# Altium project 2017-7-13-STM32F103XX最小系统板.PrjPcb
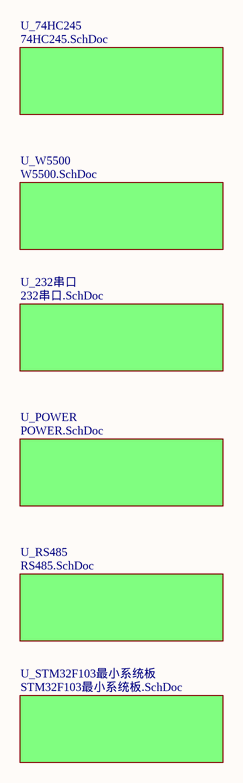
[diagram p0: SYS.SchDoc]
7 sheets, 241 parts. Net scope: global (net labels, ports and power ports of the same name join across sheets).
Board file: STM32F103最小系统板V1_0.PcbDoc
Sheets:
  SYS.SchDoc
    U_74HC245 = 74HC245.SchDoc
    U_232串口 = 232串口.SchDoc
    U_POWER = POWER.SchDoc
    U_RS485 = RS485.SchDoc
    U_STM32F103最小系统板 = STM32F103最小系统板.SchDoc
    U_W5500 = W5500.SchDoc

## Sheet SYS.SchDoc
size A4

### Sub-sheets
U_74HC245 = 74HC245.SchDoc: no entries
U_232串口 = 232串口.SchDoc: no entries
U_POWER = POWER.SchDoc: no entries
U_RS485 = RS485.SchDoc: no entries
U_STM32F103最小系统板 = STM32F103最小系统板.SchDoc: no entries
U_W5500 = W5500.SchDoc: no entries

## Sheet 74HC245.SchDoc
size A4
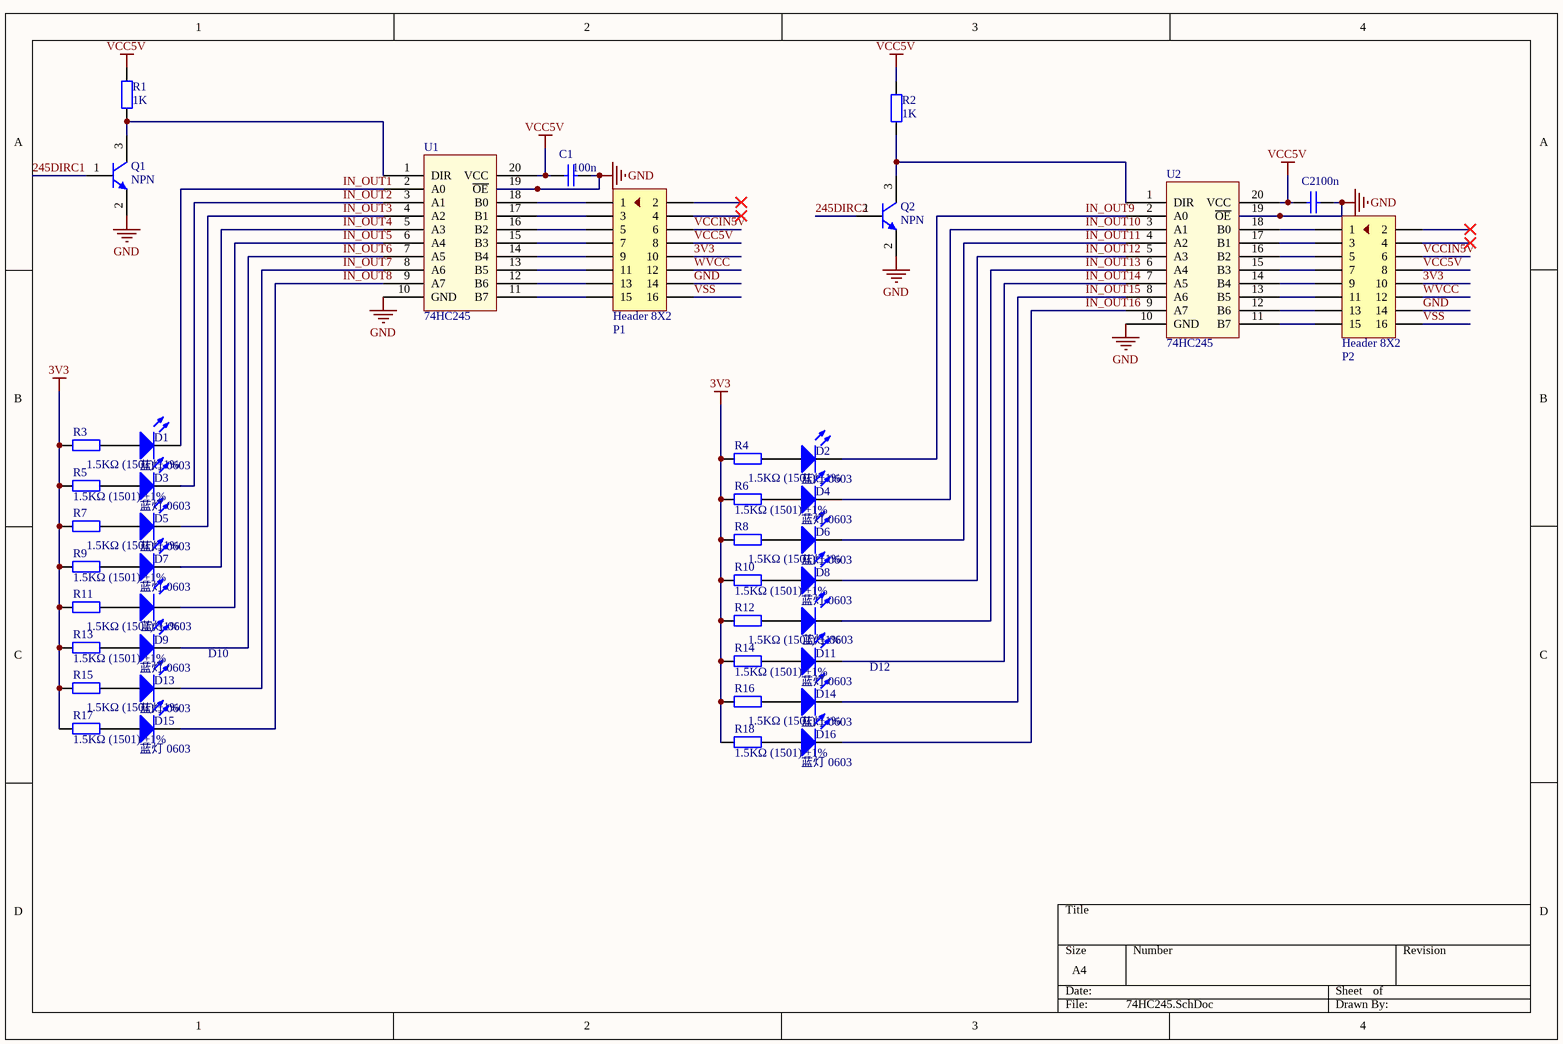
[diagram p1: 74HC245.SchDoc]

### Parts
(Parts that share a designator on the sheet are numbered #1, #2 ... from top to bottom, then left to right.)
C1#1  value 100n  [LC-0603_C]  (hidden comment: 104)
C2#1  value 100n  [LC-0603_C]  (hidden comment: 104)
D1#1  蓝灯 0603  [LC-0603_LED_S1]
D2  蓝灯 0603  [LC-0603_LED_S1]
D3  蓝灯 0603  [LC-0603_LED_S1]
D4  蓝灯 0603  [LC-0603_LED_S1]
D5  蓝灯 0603  [LC-0603_LED_S1]
D6  蓝灯 0603  [LC-0603_LED_S1]
D7#1  蓝灯 0603  [LC-0603_LED_S1]
D8  蓝灯 0603  [LC-0603_LED_S1]
D9  蓝灯 0603  [LC-0603_LED_S1]
D10  蓝灯 0603  [LC-0603_LED_S1]
D11  蓝灯 0603  [LC-0603_LED_S1]
D12  蓝灯 0603  [LC-0603_LED_S1]
D13  蓝灯 0603  [LC-0603_LED_S1]
D14  蓝灯 0603  [LC-0603_LED_S1]
D15  蓝灯 0603  [LC-0603_LED_S1]
D16#1  蓝灯 0603  [LC-0603_LED_S1]
P1  Header 8X2  [DC3-16P-2.54mm]
P2  Header 8X2  [DC3-16P-2.54mm]
Q1#1  NPN  [SOT23-3]
Q2  NPN  [SOT23-3]
R1#1  value 1K  [0603-1]  (hidden comment: Res1)
R2  value 1K  [0603-1]  (hidden comment: Res1)
R3#1  1.5KΩ (1501) ±1%  [LC-0603_R]
R4#1  1.5KΩ (1501) ±1%  [LC-0603_R]
R5  1.5KΩ (1501) ±1%  [LC-0603_R]
R6  1.5KΩ (1501) ±1%  [LC-0603_R]
R7  1.5KΩ (1501) ±1%  [LC-0603_R]
R8  1.5KΩ (1501) ±1%  [LC-0603_R]
R9  1.5KΩ (1501) ±1%  [LC-0603_R]
R10  1.5KΩ (1501) ±1%  [LC-0603_R]
R11  1.5KΩ (1501) ±1%  [LC-0603_R]
R12  1.5KΩ (1501) ±1%  [LC-0603_R]
R13  1.5KΩ (1501) ±1%  [LC-0603_R]
R14  1.5KΩ (1501) ±1%  [LC-0603_R]
R15#1  1.5KΩ (1501) ±1%  [LC-0603_R]
R16#1  1.5KΩ (1501) ±1%  [LC-0603_R]
R17#1  1.5KΩ (1501) ±1%  [LC-0603_R]
R18#1  1.5KΩ (1501) ±1%  [LC-0603_R]
U1  74HC245  [LC-TSSOP-20]
U2  74HC245  [LC-TSSOP-20]

### Nets
3V3: P1.10 P2.10 R3#1.1 R4#1.1 R5.1 R6.1 R7.1 R8.1 R9.1 R10.1 R11.1 R12.1 R13.1 R14.1 R15#1.1 R16#1.1 R17#1.1 R18#1.1
GND: C1#1.1 C2#1.1 P1.14 P2.14 Q1#1.2(E) Q2.2(E) U1.10(GND) U1.19(~{OE}) U2.10(GND) U2.19(~{OE})
VCC5V: C1#1.2 C2#1.2 P1.8 P2.8 R1#1.2 R2.2 U1.20(VCC) U2.20(VCC)
VCCIN5V: P1.6 P2.6
VSS: P1.16 P2.16
WVCC: P1.12 P2.12  [project net VCC3.3]
245DIRC1: Q1#1.1(B)
245DIRC2: Q2.1(B)
IN_OUT1: D1#1.K U1.2(A0)
IN_OUT2: D3.K U1.3(A1)
IN_OUT3: D5.K U1.4(A2)
IN_OUT4: D7#1.K U1.5(A3)
IN_OUT5: D10.K U1.6(A4)
IN_OUT6: D9.K U1.7(A5)
IN_OUT7: D13.K U1.8(A6)
IN_OUT8: D15.K U1.9(A7)
IN_OUT9: D2.K U2.2(A0)
IN_OUT10: D4.K U2.3(A1)
IN_OUT11: D6.K U2.4(A2)
IN_OUT12: D8.K U2.5(A3)
IN_OUT13: D12.K U2.6(A4)
IN_OUT14: D11.K U2.7(A5)
IN_OUT15: D14.K U2.8(A6)
IN_OUT16: D16#1.K U2.9(A7)
NetD1#1_A: D1#1.A R3#1.2
NetD2_A: D2.A R4#1.2
NetD3_A: D3.A R5.2
NetD4_A: D4.A R6.2
NetD5_A: D5.A R7.2
NetD6_A: D6.A R8.2
NetD7#1_A: D7#1.A R9.2
NetD8_A: D8.A R10.2
NetD9_A: D9.A R13.2
NetD10_A: D10.A R11.2
NetD11_A: D11.A R14.2
NetD12_A: D12.A R12.2
NetD13_A: D13.A R15#1.2
NetD14_A: D14.A R16#1.2
NetD15_A: D15.A R17#1.2
NetD16#1_A: D16#1.A R18#1.2
NetP1_1: P1.1 U1.18(B0)
NetP1_3: P1.3 U1.17(B1)
NetP1_5: P1.5 U1.16(B2)
NetP1_7: P1.7 U1.15(B3)
NetP1_9: P1.9 U1.14(B4)
NetP1_11: P1.11 U1.13(B5)
NetP1_13: P1.13 U1.12(B6)
NetP1_15: P1.15 U1.11(B7)
NetP2_1: P2.1 U2.18(B0)
NetP2_3: P2.3 U2.17(B1)
NetP2_5: P2.5 U2.16(B2)
NetP2_7: P2.7 U2.15(B3)
NetP2_9: P2.9 U2.14(B4)
NetP2_11: P2.11 U2.13(B5)
NetP2_13: P2.13 U2.12(B6)
NetP2_15: P2.15 U2.11(B7)
NetQ1#1_3: Q1#1.3(C) R1#1.1 U1.1(DIR)
NetQ2_3: Q2.3(C) R2.1 U2.1(DIR)

Not connected (* = marked no-connect by the designer): P1 2* 4*; P2 2* 4*

### Library data of the parts
C1#1 C2#1 = Cap: Capacitor; Published: 8-Jun-2000; LatestRevisionDate: 17-Jul-2002; LatestRevisionNote: Re-released for DXP Platform.; PackageReference: RAD-0.3; Publisher: Altium Limited
D1#1 D2-D6 D7#1 D8-D15 D16#1 = 0603 蓝灯: 发光二极管; ComponentLink1Description: 供应商链接; ComponentLink1URL: http://www.szlcsc.com/product/details_73150.html; Package: 0603; Supplier: LC; SuppliersPartNumber: C72041
P1 P2 = Header 8X2: 接插件; LatestRevisionDate: 17-Jul-2002; LatestRevisionNote: Re-released for DXP Platform.; Publisher: Altium Limited
Q1#1 Q2 = NPN1: 贴片三极管; Published: 8-Jun-2000; LatestRevisionDate: 15-Jan-2003; LatestRevisionNote: PCB Footprint 'BCY-W3/D4.7' replaced; DatasheetDocument: 1997; PackageDocument: Sep-1998; PackageReference: TO-92A; Publisher: Altium Limited; Code_JEDEC: TO-92A; ComponentLink1Description: Manufacturer Link; ComponentLink1URL: http://www.fairchildsemi.com/; ComponentLink2Description: Datasheet; ComponentLink2URL: http://www.fairchildsemi.com/ds/2N%2F2N3904.pdf
R1#1 R2 = Res1: 贴片电阻; Published: 8-Jun-2000; LatestRevisionDate: 17-Jul-2002; LatestRevisionNote: Re-released for DXP Platform.; PackageReference: AXIAL-0.4; Publisher: Altium Limited
R3#1 R4#1 R5-R14 R15#1 R16#1 R17#1 R18#1 = 0603 1.5KΩ (1501) 1%: 贴片电阻; ComponentLink1Description: 供应商链接; ComponentLink1URL: http://www.szlcsc.com/product/details_23570.html; Package: 0603; Supplier: LC; SuppliersPartNumber: C22843
U1 U2 = 7

## Sheet 232串口.SchDoc
size A4
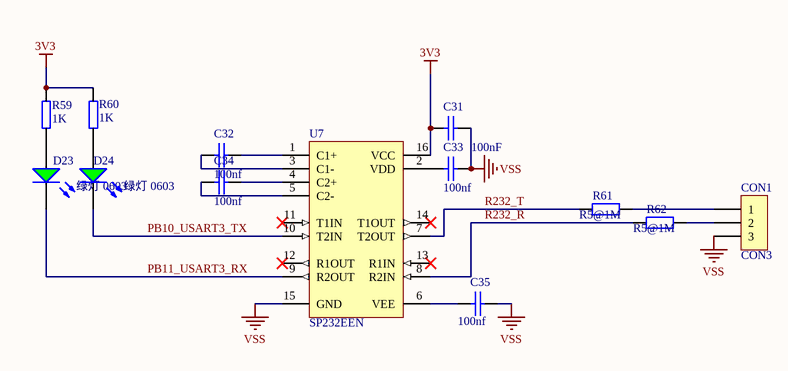
[diagram p2: 232串口.SchDoc]

### Parts
(Parts that share a designator on the sheet are numbered #1, #2 ... from top to bottom, then left to right.)
C31  100nF  [LC-0603_C]
C32  100nf  [LC-0603_C]
C33  100nf  [LC-0603_C]
C34  100nf  [LC-0603_C]
C35  100nf  [LC-0603_C]
CON1#1  CON3  [VH3.96-W-3P]
D23  绿灯 0603  [LC-0603_LED_S1]
D24  绿灯 0603  [LC-0603_LED_S1]
R59  1K  [LC-0603_R]
R60  1K  [LC-0603_R]
R61  R5@1M  [0603-1]
R62  R5@1M  [0603-1]
U7  SP232EEN  [SOIC-16]

### Nets
3V3: C31.2 R59.2 R60.1 U7.16(VCC)
VSS: C31.1 C33.2 C35.2 CON1#1.3 U7.15(GND)
PB10_USART3_TX: D24.K U7.10(T2IN)
PB11_USART3_RX: D23.K U7.9(R2OUT)
R232_R: R62.2 U7.8(R2IN)
R232_T: R61.2 U7.7(T2OUT)
NetC32_1: C32.1 U7.3(C1-)
NetC32_2: C32.2 U7.1(C1+)
NetC33_1: C33.1 U7.2(VDD)
NetC34_1: C34.1 U7.5(C2-)
NetC34_2: C34.2 U7.4(C2+)
NetC35_1: C35.1 U7.6(VEE)
NetCON1#1_1: CON1#1.1 R61.1
NetCON1#1_2: CON1#1.2 R62.1
NetD23_A: D23.A R59.1
NetD24_A: D24.A R60.2

Not connected (* = marked no-connect by the designer): U7 11(T1IN)* 12(R1OUT)* 13(R1IN)* 14(T1OUT)*

### Library data of the parts
C31-C35 = CAP: Capacitor
CON1#1 = CON3: Connector
D23 D24 = 0603 绿灯: 发光二极管; ComponentLink1Description: 供应商链接; ComponentLink1URL: http://www.szlcsc.com/product/details_73152.html; Package: 0603; Supplier: LC; SuppliersPartNumber: C72043
R59 R60 = RES2
R61 R62 = Res2: Resistor; Value: 10K; Published: 8-Jun-2000; LatestRevisionDate: 17-Jul-2002; LatestRevisionNote: Re-released for DXP Platform.; PackageReference: AXIAL-0.4; Publisher: Altium Limited
U7 = MAX232: +5V Powered, Multi-Channel RS-232 Driver/Receiver; Published: 16-Jan-2001; LatestRevisionDate: 13-Apr-2006; LatestRevisionNote: IPC-7351 Footprint Added.; PackageReference: NSO16; Publisher: Altium Limited; PackageDescription: 16-Pin Small Outline Integrated Circuit 1.27 mm Pitch; Code_JEDEC: MS-012-AC; Code_IPC: SOIC127P600-16; ComponentLink1Description: Manufacturer Link; ComponentLink1URL: http://www.maxim-ic.com/; ComponentLink2Description: Datasheet; ComponentLink2URL: http://pdfserv.maxim-ic.com/en/ds/MAX220-MAX249.pdf

## Sheet POWER.SchDoc
size A4
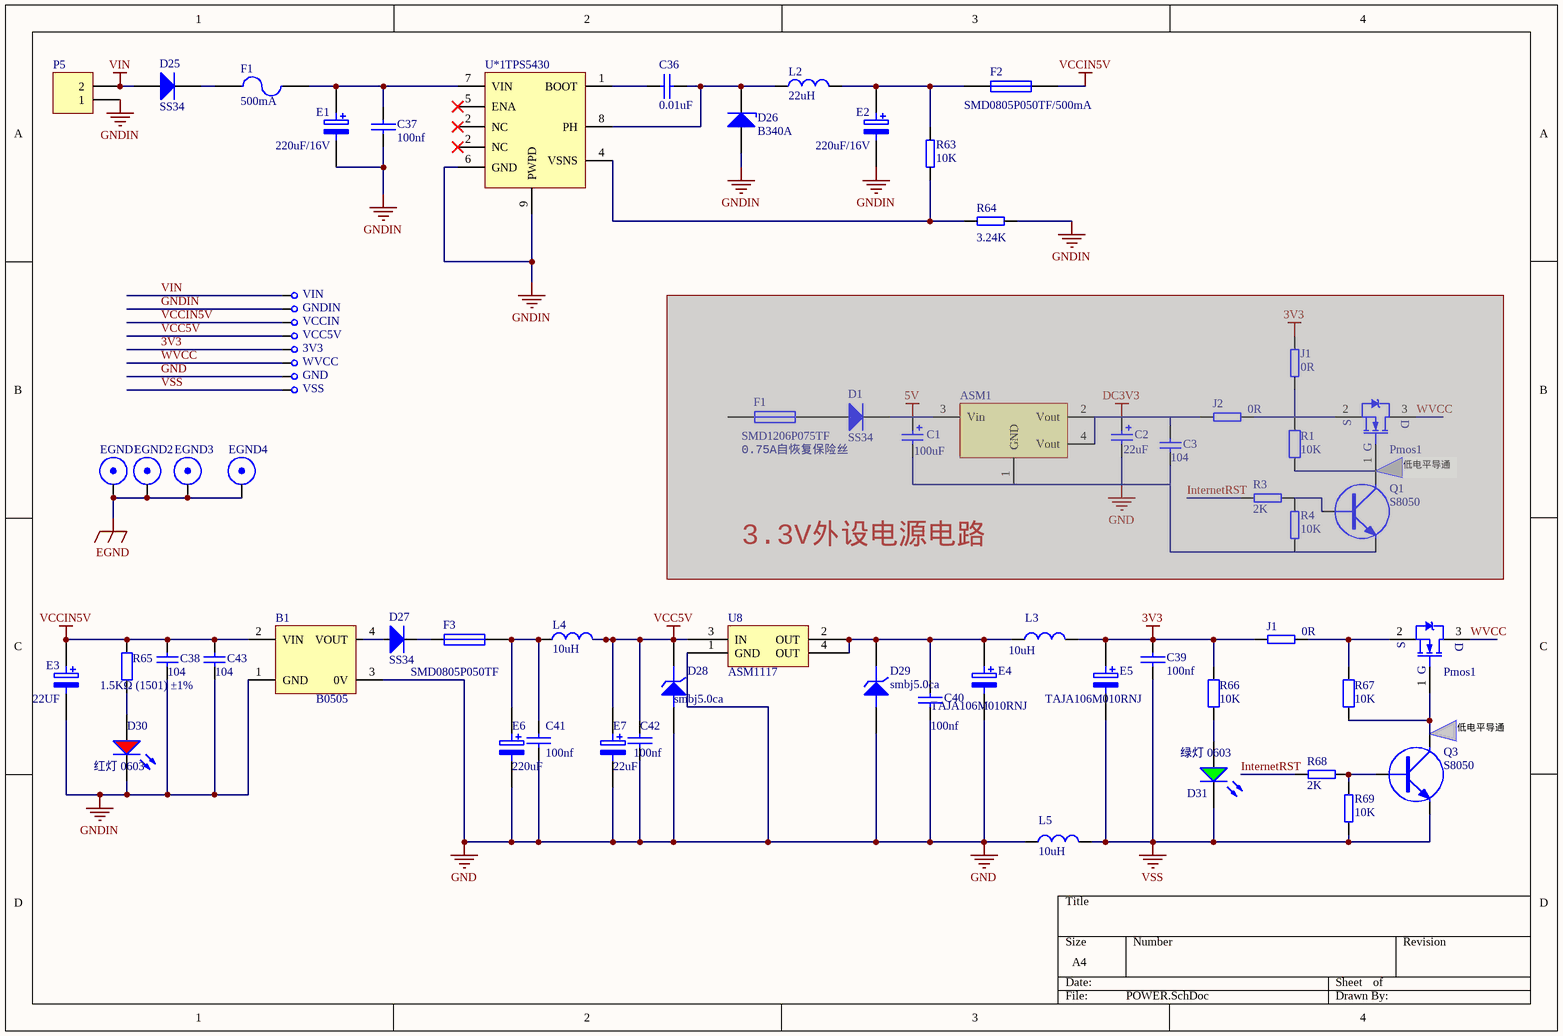
[diagram p3: POWER.SchDoc]

### Parts
(Parts that share a designator on the sheet are numbered #1, #2 ... from top to bottom, then left to right.)
3V3  CHECK  [CHECK-B]  (value not drawn)
ASM1  ASM1117-3.3  [LC-SOT-223]  (value not drawn)  (masked out: inside a compile mask, not in the netlist)
B1  B0505  [B0505D-1WR2]
C1#2  100uF  [HONOR_63X54]  (masked out: inside a compile mask, not in the netlist)
C2#2  22uF  [HONOR_63X54]  (masked out: inside a compile mask, not in the netlist)
C3#1  104  [LC-0603_C]  (masked out: inside a compile mask, not in the netlist)
C36  0.01uF  [C-0805]
C37  100nf  [1206]
C38  104  [LC-0603_C]
C39  100nf  [LC-0603_C]
C40  100nf  [LC-0603_C]
C41  100nf  [LC-0603_C]
C42  100nf  [LC-0603_C]
C43  104  [LC-0603_C]
D1#2  SS34  [LC-SMA(DO-214AC)_S5]  (masked out: inside a compile mask, not in the netlist)
D25  SS34  [D-SMA]
D26  value B340A  [D-SMB]  (hidden comment: Diode-Z)
D27  SS34  [D-SMA]
D28  smbj5.0ca  [LC-SMB(DO-214AA)_S1]
D29  smbj5.0ca  [LC-SMB(DO-214AA)_S1]
D30  红灯 0603  [LC-0603_LED_S1]
D31  绿灯 0603  [LC-0603_LED_S1]
E1  220uF/16V  [C-RB-SD6]
E2  220uF/16V  [C-RB-SD6]
E3  22UF  [C-RB-SD6]
E4  TAJA106M010RNJ  [LC-CASE-A_3216]
E5  TAJA106M010RNJ  [LC-CASE-A_3216]
E6#1  220uF  [C-RB-SD6]
E7  22uF  [C-RB-SD6]
EGND1  EGND  [H-6-3.2m]  (value not drawn)
EGND2  EGND  [H-6-3.2m]  (value not drawn)
EGND3  EGND  [H-6-3.2m]  (value not drawn)
EGND4  EGND  [H-6-3.2m]  (value not drawn)
F1#1  value 500mA  [1206]  (hidden comment: Fuse2)
F1#2  SMD1206P075TF  [LC-1206_R]  (masked out: inside a compile mask, not in the netlist)
F2#1  SMD0805P050TF/500mA  [0805-1]
F3  SMD0805P050TF  [0805-1]
GND  CHECK  [CHECK-B]  (value not drawn)
GNDIN  CHECK  [CHECK-B]  (value not drawn)
J1#1  0R  [LC-0603_L]  (masked out: inside a compile mask, not in the netlist)
J1#2  0R  [LC-0603_L]
J2  0R  [LC-0603_L]  (masked out: inside a compile mask, not in the netlist)
L2  value 22uH  [L-SMD-7]  (hidden comment: Inductor)
L3  value 10uH  [0805-1]  (hidden comment: Inductor)
L4  value 10uH  [L-SMD-3]  (hidden comment: Inductor)
L5  value 10uH  [0805-1]  (hidden comment: Inductor)
P5  Header 2  [WJ2EDGR508-2]  (value not drawn)
Pmos1#1  SI2301  [LC-SOT-23(SOT-23-3)]  (value not drawn)  (masked out: inside a compile mask, not in the netlist)
Pmos1#2  SI2301  [LC-SOT-23(SOT-23-3)]  (value not drawn)
Q1#2  S8050  [LC-SOT-23(SOT-23-3)]  (masked out: inside a compile mask, not in the netlist)
Q3  S8050  [LC-SOT-23(SOT-23-3)]
R1#2  10K  [LC-0603_R]  (masked out: inside a compile mask, not in the netlist)
R3#2  2K  [LC-0603_R]  (masked out: inside a compile mask, not in the netlist)
R4#2  10K  [LC-0603_R]  (masked out: inside a compile mask, not in the netlist)
R63  10K  [LC-0603_R]
R64  3.24K  [LC-0603_R]
R65  1.5KΩ (1501) ±1%  [LC-0603_R]
R66  10K  [LC-0603_R]
R67  10K  [LC-0603_R]
R68  2K  [LC-0603_R]
R69  10K  [LC-0603_R]
U8  ASM1117  [SOT223]
U*1  TPS5430  [SOIC8]
VCC5V  CHECK  [CHECK-B]  (value not drawn)
VCCIN  CHECK  [CHECK-B]  (value not drawn)
VIN  CHECK  [CHECK-B]  (value not drawn)
VSS  CHECK  [CHECK-B]  (value not drawn)
WVCC  CHECK  [CHECK-B]  (value not drawn)

### Nets
3V3: 3V3.1 C39.2 E5.1 J1#2.2 L3.2 R66.1
EGND: EGND1.0 EGND2.0 EGND3.0 EGND4.0
GND: B1.3(0V) C40.1 C41.1 C42.1 D28.1(A) D29.1(A) E4.2 E6#1.2 E7.2 GND.1 L5.1 U8.1(GND)
GNDIN: B1.1(GND) C37.1 C38.2 C43.2 D26.1(A) D30.K E1.2 E2.2 E3.2 GNDIN.1 P5.1 R64.1 U*1.6(GND) U*1.9(PWPD)
VCC5V: C42.2 D28.2(K) E7.1 L4.2 U8.3(IN) VCC5V.1
VCCIN5V: B1.2(VIN) C38.1 C43.1 E3.1 F2#1.2 R65.2 VCCIN.1
VIN: D25.1(A) P5.2 VIN.1
VSS: C39.1 D31.K E5.2 L5.2 Q3.2 R69.1 VSS.1
WVCC: Pmos1#2.3(D) WVCC.1  [project net VCC3.3]
InternetRST: R68.2
NetB1_4: B1.4(VOUT) D27.1(A)
NetC36_1: C36.1 D26.2(K) L2.1 U*1.8(PH)
NetC36_2: C36.2 U*1.1(BOOT)
NetC37_2: C37.2 E1.1 F1#1.2 U*1.7(VIN)
NetC40_2: C40.2 D29.2(K) E4.1 L3.1 U8.2(OUT) U8.4(OUT)
NetC41_2: C41.2 E6#1.1 F3.2 L4.1
NetD25_2: D25.2(K) F1#1.1
NetD27_2: D27.2(K) F3.1
NetD30_A: D30.A R65.1
NetD31_A: D31.A R66.2
NetE2_1: E2.1 F2#1.1 L2.2 R63.2
NetJ1#2_1: J1#2.1 Pmos1#2.2(S) R67.2
NetPmos1#2_1: Pmos1#2.1(G) Q3.3 R67.1
NetQ3_1: Q3.1 R68.1 R69.2
NetR63_1: R63.1 R64.2 U*1.4(VSNS)

Not connected (* = marked no-connect by the designer): U*1 2(NC)* 5(ENA)*

### Notes on the sheet
- (near F1#2) 0.75A自恢复保险丝
- 低电平导通
- 3.3V外设电源电路
- (near Q3) 低电平导通

### Library data of the parts
3V3 GND GNDIN VCC5V VCCIN VIN VSS WVCC = CHECK: 测试点
ASM1 = VOLTREG1
C1#2 C2#2 = Cap Pol1: Polarized Capacitor (Radial); Published: 8-Jun-2000; Revision: July-2002: Re-released for DXP Platform.; Publisher: Altium Limited
  C1#2: Value: 100uF
  C2#2: Value: 22uF
C3#1 C38 C43 = Cap: Capacitor; Value: 100nF; Published: 8-Jun-2000; Revision: July-2002: Re-released for DXP Platform.; Publisher: Altium Limited
C36 C37 C39-C42 = CAP: Capacitor
D1#2 = Diode: Default Diode; Published: 8-Jun-2000; LatestRevisionDate: 17-Jul-2002; LatestRevisionNote: Re-released for DXP Platform.; PackageDocument: Sep-1996; PackageReference: SMC; Publisher: Altium Limited; Code_JEDEC: DO-214-AB
D25 D27 = Diode: 二极管; Published: 8-Jun-2000; LatestRevisionDate: 17-Jul-2002; LatestRevisionNote: Re-released for DXP Platform.; PackageDocument: Sep-1996; PackageReference: SMC; Publisher: Altium Limited; Code_JEDEC: DO-214-AB
D26 = Diode-Z: 稳压二极管; Published: 8-Jun-2000; LatestRevisionDate: 17-Jul-2002; LatestRevisionNote: Re-released for DXP Platform.; PackageReference: SMB; Publisher: Altium Limited; Code_JEDEC: DO-214-AA
D28 D29 = ZENER3: Zener Diode
D30 = 0603 红灯: 发光二极管; ComponentLink1Description: 供应商链接; ComponentLink1URL: http://www.szlcsc.com/product/details_2659.html; Package: 0603; Supplier: LC; SuppliersPartNumber: C2286
D31 = 0603 绿灯: 发光二极管; ComponentLink1Description: 供应商链接; ComponentLink1URL: http://www.szlcsc.com/product/details_73152.html; Package: 0603; Supplier: LC; SuppliersPartNumber: C72043
E1-E5 E6#1 E7 = ELECTRO2: Electrolytic Capacitor
F1#1 = Fuse2: 可恢复保险丝; Published: 8-Jun-2000; LatestRevisionDate: 17-Jul-2002; LatestRevisionNote: Re-released for DXP Platform.; PackageReference: PIN-W2/E2.8; Publisher: Altium Limited
F1#2 F2#1 F3 = Fuse 1: Fuse; Published: 8-Jun-2000; LatestRevisionDate: 17-Jul-2002; LatestRevisionNote: Re-released for DXP Platform.; PackageReference: PIN-W2/E2.8; Publisher: Altium Limited
J1#1 J1#2 J2 R3#2 R4#2 R68 R69 = RES
L2-L5 = Inductor: 电感; Code_IEC: 1005; Published: 8-Jun-2000; LatestRevisionDate: 17-Jul-2002; LatestRevisionNote: Re-released for DXP Platform.; PackageReference: 0402-A; Publisher: Altium Limited; Code_JEITA: 0402
P5 = Header 2: Header, 2-Pin; LatestRevisionDate: 17-Jul-2002; LatestRevisionNote: Re-released for DXP Platform.; Publisher: Altium Limited
Pmos1#1 Pmos1#2 = N-MOS
Q1#2 Q3 = NPN
R1#2 R67 = Res2: Resistor; Published: 8-Jun-2000; LatestRevisionDate: 17-Jul-2002; LatestRevisionNote: Re-released for DXP Platform.; PackageReference: AXIAL-0.4; Publisher: Altium Limited; Value: 10K
R63 R64 = RES2
R65 = 0603 1.5KΩ (1501) 1%: 贴片电阻; ComponentLink1Description: 供应商链接; ComponentLink1URL: http://www.szlcsc.com/product/details_23570.html; Package: 0603; Supplier: LC; SuppliersPartNumber: C22843
R66 = Res2: Resistor; Value: 1K; Published: 8-Jun-2000; LatestRevisionDate: 17-Jul-2002; LatestRevisionNote: Re-released for DXP Platform.; PackageReference: AXIAL-0.4; Publisher: Altium Limited
U8 = ASM1: 3.3V稳压芯片

## Sheet RS485.SchDoc
size A4
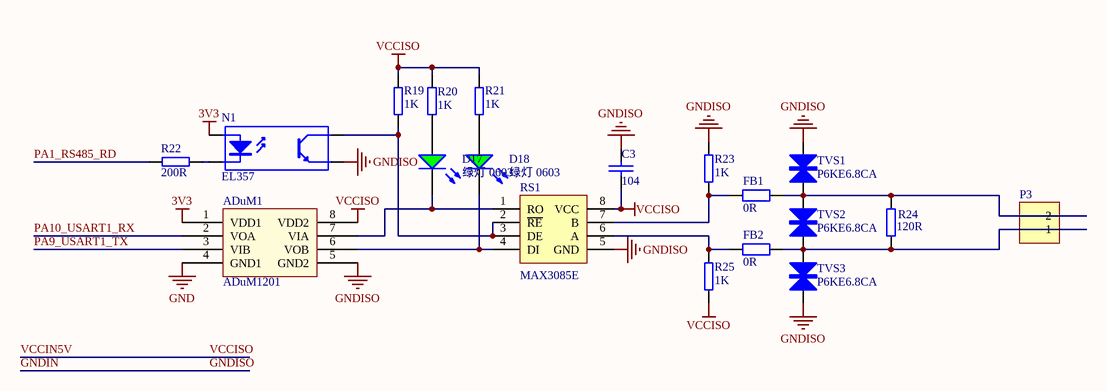
[diagram p4: RS485.SchDoc]

### Parts
(Parts that share a designator on the sheet are numbered #1, #2 ... from top to bottom, then left to right.)
ADuM1  ADuM1201  [SOIC-8]
C3#2  104  [LC-0603_C]
D17  绿灯 0603  [LC-0603_LED_S1]
D18  绿灯 0603  [LC-0603_LED_S1]
FB1  0R  [LC-0603_L]
FB2  0R  [LC-0603_L]
N1  EL357  [lc-sop-4_P2.54]
P3  Header 2  [WJ2EDGR508-2]  (value not drawn)
R19  1K  [LC-0603_R]
R20  1K  [LC-0603_R]
R21  1K  [LC-0603_R]
R22  200R  [LC-0603_R]
R23  1K  [LC-0603_R]
R24  120R  [LC-0603_R]
R25  1K  [LC-0603_R]
RS1  MAX3085E  [SOIC-8]
TVS1  P6KE6.8CA  [TVS]
TVS2  P6KE6.8CA  [TVS]
TVS3  P6KE6.8CA  [TVS]

### Nets
3V3: ADuM1.1(VDD1) N1.1(A)
GND: ADuM1.4(GND1)
GNDIN: ADuM1.5(GND2) C3#2.1 N1.3(E) R23.1 RS1.5(GND) TVS1.2 TVS3.1  [also labelled GNDISO]
VCCIN5V: ADuM1.8(VDD2) C3#2.2 R19.1 R20.2 R21.1 R25.2 RS1.8(VCC)  [also labelled VCCISO]
PA1_RS485_RD: R22.1
PA9_USART1_TX: ADuM1.3(VIB)
PA10_USART1_RX: ADuM1.2(VOA)
NetADuM1_6: ADuM1.6(VOB) D18.K RS1.4(DI)
NetADuM1_7: ADuM1.7(VIA) D17.K RS1.1(RO)
NetD17_A: D17.A R20.1
NetD18_A: D18.A R21.2
NetFB1_1: FB1.1 P3.2 R24.2 TVS1.1 TVS2.2
NetFB1_2: FB1.2 R23.2 RS1.7(B)
NetFB2_1: FB2.1 P3.1 R24.1 TVS2.1 TVS3.2
NetFB2_2: FB2.2 R25.1 RS1.6(A)
NetN1_2: N1.2(K) R22.2
NetN1_4: N1.4(C) R19.2 RS1.2(~{RE}) RS1.3(DE)

### Library data of the parts
C3#2 = CAP
D17 D18 = 0603 绿灯: 发光二极管; ComponentLink1Description: 供应商链接; ComponentLink1URL: http://www.szlcsc.com/product/details_73152.html; Package: 0603; Supplier: LC; SuppliersPartNumber: C72043
FB1 FB2 = Res2: Resistor; Published: 8-Jun-2000; LatestRevisionDate: 17-Jul-2002; LatestRevisionNote: Re-released for DXP Platform.; PackageReference: AXIAL-0.4; Publisher: Altium Limited; Value: 0R
N1 = ST188: 反射式光电传感器; Published: 24-Mar-1999; LatestRevisionDate: 04-Mar-2005; LatestRevisionNote: Sch pins 3 & 4 Swapped.; DatasheetDocument: Nov-2003; PackageReference: DIP-4; Publisher: Altium Limited
P3 = Header 2: Header, 2-Pin; LatestRevisionDate: 17-Jul-2002; LatestRevisionNote: Re-released for DXP Platform.; Publisher: Altium Limited
R19-R22 = RES2
R23-R25 = RES
TVS1-TVS3 = TVS

## Sheet STM32F103最小系统板.SchDoc
size A3
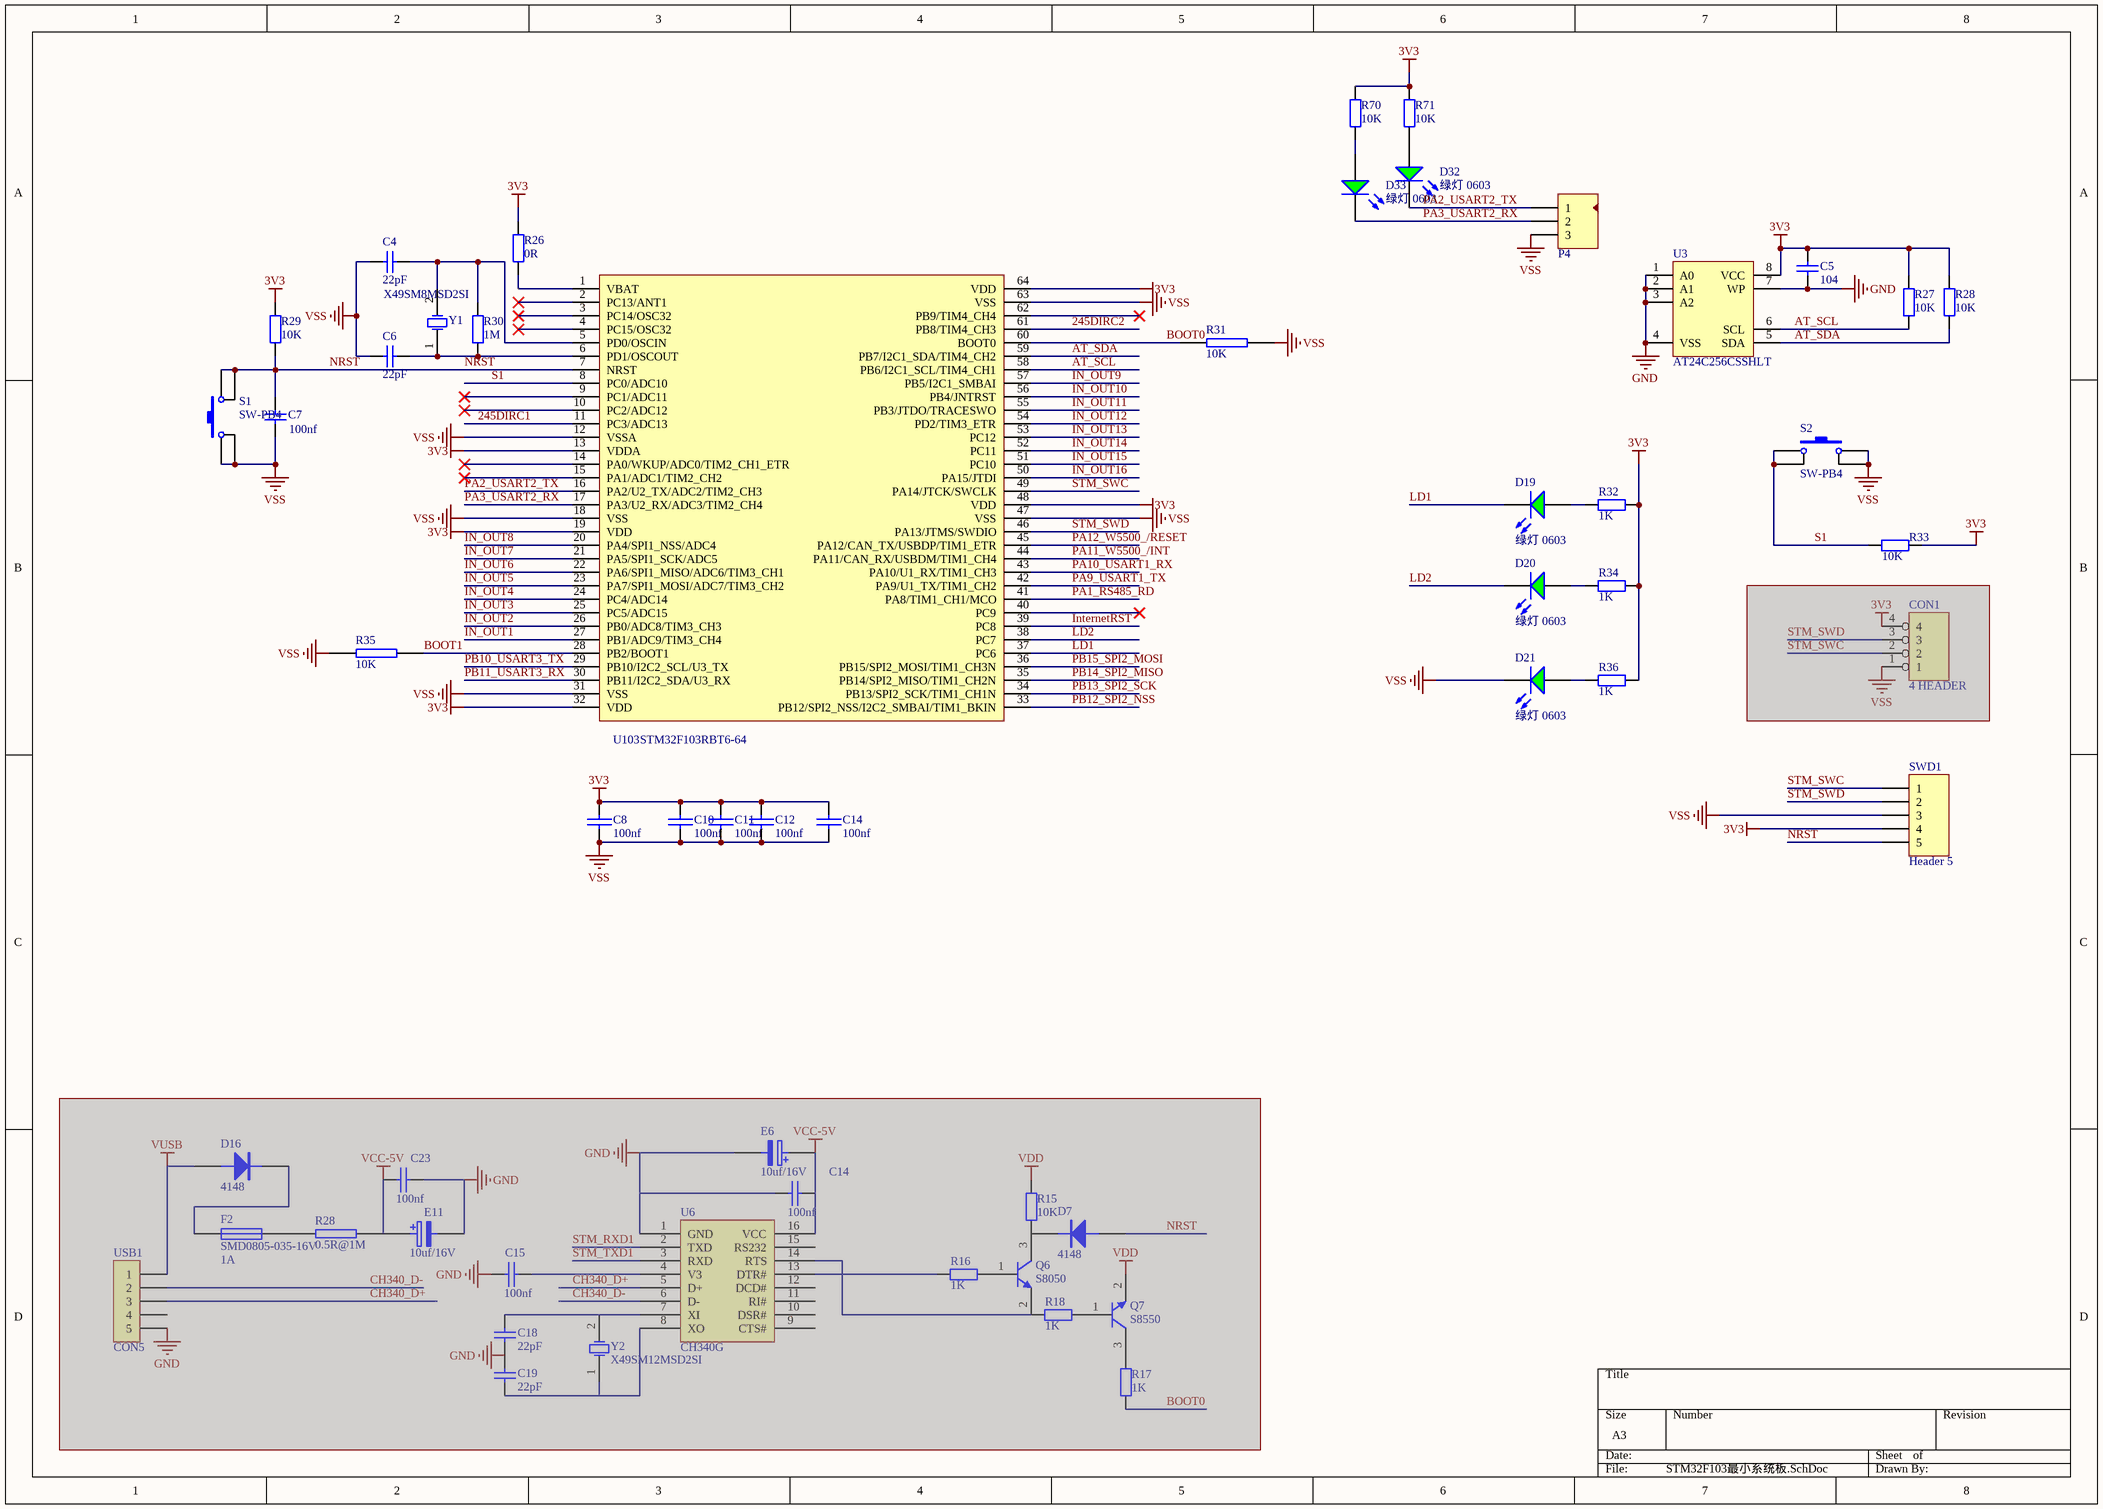
[diagram p5: STM32F103最小系统板.SchDoc]

### Parts
(Parts that share a designator on the sheet are numbered #1, #2 ... from top to bottom, then left to right.)
C4  22pF  [LC-0603_C]
C5  104  [LC-0603_C]
C6  22pF  [LC-0603_C]
C7  100nf  [LC-0603_C]
C8  100nf  [LC-0603_C]
C10  100nf  [LC-0603_C]
C11  100nf  [LC-0603_C]
C12  100nf  [LC-0603_C]
C14#1  100nf  [LC-0603_C]
C14#2  100nf  [LC-0603_C]  (masked out: inside a compile mask, not in the netlist)
C15  100nf  [LC-0603_C]  (masked out: inside a compile mask, not in the netlist)
C18#1  22pF  [LC-0603_C]  (masked out: inside a compile mask, not in the netlist)
C19#1  22pF  [LC-0603_C]  (masked out: inside a compile mask, not in the netlist)
C23#1  100nf  [LC-0603_C]  (masked out: inside a compile mask, not in the netlist)
CON1#2  4 HEADER  [HDR4X1-2.54]  (masked out: inside a compile mask, not in the netlist)
D7#2  4148  [LC-LL-34]  (masked out: inside a compile mask, not in the netlist)
D16#2  4148  [LC-LL-34]  (masked out: inside a compile mask, not in the netlist)
D19  绿灯 0603  [LC-0603_LED_S1]
D20  绿灯 0603  [LC-0603_LED_S1]
D21  绿灯 0603  [LC-0603_LED_S1]
D32  绿灯 0603  [LC-0603_LED_S1]
D33  绿灯 0603  [LC-0603_LED_S1]
E6#2  10uf/16V  [LC-CASE-A_3216]  (masked out: inside a compile mask, not in the netlist)
E11  10uf/16V  [LC-CASE-A_3216]  (masked out: inside a compile mask, not in the netlist)
F2#2  SMD0805-035-16V  value 1A  [LC-0805_R]  (masked out: inside a compile mask, not in the netlist)
P4  Header 3  [HDR3X1-2.54]  (value not drawn)
Q6  S8050  [LC-SOT-23(SOT-23-3)]  (masked out: inside a compile mask, not in the netlist)
Q7  S8550  [LC-SOT-23(SOT-23-3)]  (masked out: inside a compile mask, not in the netlist)
R15#2  10K  [LC-0603_R]  (masked out: inside a compile mask, not in the netlist)
R16#2  1K  [LC-0603_R]  (masked out: inside a compile mask, not in the netlist)
R17#2  1K  [LC-0603_R]  (masked out: inside a compile mask, not in the netlist)
R18#2  1K  [LC-0603_R]  (masked out: inside a compile mask, not in the netlist)
R26  0R  [LC-0603_R]
R27  10K  [LC-0603_R]
R28#1  10K  [LC-0603_R]
R28#2  0.5R@1M  [LC-0805_R]  (masked out: inside a compile mask, not in the netlist)
R29  10K  [LC-0603_R]
R30  1M  [LC-0603_R]
R31  10K  [LC-0603_R]
R32  1K  [0603-1]
R33  10K  [LC-0603_R]
R34  1K  [0603-1]
R35  10K  [LC-0603_R]
R36  1K  [0603-1]
R70  10K  [LC-0603_R]
R71  10K  [LC-0603_R]
S1  SW-PB4  [SW_PB4_A1]
S2  SW-PB4  [SW_PB4_A1]
SWD1  Header 5  [HDR1X5]
U3  AT24C256CSSHLT  [SOIC-8]
U6#1  CH340G  [LC-SOIC-16_150mil]
U103  STM32F103RBT6-64  [LC-LQFP-64_10x10x05P]
USB1  CON5  [USB_MICRO]  (masked out: inside a compile mask, not in the netlist)
Y1  X49SM8MSD2SI  [LC-HC-49SMD]
Y2#1  X49SM12MSD2SI  [LC-HC-49SMD]  (masked out: inside a compile mask, not in the netlist)

### Nets
3V3: C5.1 C8.2 C10.2 C11.2 C12.2 C14#1.2 R26.1 R27.1 R28#1.1 R29.2 R32.1 R33.2 R34.1 R36.2 R70.1 R71.1 SWD1.4 U3.8(VCC) U103.13(VDDA) U103.19(VDD) U103.32(VDD) U103.48(VDD) U103.64(VDD)
GND: C5.2 U3.1(A0) U3.2(A1) U3.3(A2) U3.4(VSS) U3.7(WP)
VSS: C4.1 C6.1 C7.1 C8.1 C10.1 C11.1 C12.1 C14#1.1 D21.K P4.3 R31.1 R35.1 S1.1 S1.4 S2.2 S2.3 SWD1.3 U103.12(VSSA) U103.18(VSS) U103.31(VSS) U103.47(VSS) U103.63(VSS)
245DIRC1: U103.11(PC3/ADC13)
245DIRC2: U103.61(PB8/TIM4_CH3)
AT_SCL: R27.2 U3.6(SCL) U103.58(PB6/I2C1_SCL/TIM4_CH1)
AT_SDA: R28#1.2 U3.5(SDA) U103.59(PB7/I2C1_SDA/TIM4_CH2)
BOOT0: R31.2 U103.60(BOOT0)
BOOT1: R35.2 U103.28(PB2/BOOT1)
IN_OUT1: U103.27(PB1/ADC9/TIM3_CH4)
IN_OUT2: U103.26(PB0/ADC8/TIM3_CH3)
IN_OUT3: U103.25(PC5/ADC15)
IN_OUT4: U103.24(PC4/ADC14)
IN_OUT5: U103.23(PA7/SPI1_MOSI/ADC7/TIM3_CH2)
IN_OUT6: U103.22(PA6/SPI1_MISO/ADC6/TIM3_CH1)
IN_OUT7: U103.21(PA5/SPI1_SCK/ADC5)
IN_OUT8: U103.20(PA4/SPI1_NSS/ADC4)
IN_OUT9: U103.57(PB5/I2C1_SMBAI)
IN_OUT10: U103.56(PB4/JNTRST)
IN_OUT11: U103.55(PB3/JTDO/TRACESWO)
IN_OUT12: U103.54(PD2/TIM3_ETR)
IN_OUT13: U103.53(PC12)
IN_OUT14: U103.52(PC11)
IN_OUT15: U103.51(PC10)
IN_OUT16: U103.50(PA15/JTDI)
InternetRST: U103.39(PC8)
LD1: D19.K U103.37(PC6)
LD2: D20.K U103.38(PC7)
NRST: C7.2 R29.1 S1.2 S1.3 SWD1.5 U103.7(NRST)
PA1_RS485_RD: U103.41(PA8/TIM1_CH1/MCO)
PA2_USART2_TX: D32.K P4.1 U103.16(PA2/U2_TX/ADC2/TIM2_CH3)
PA3_USART2_RX: D33.K P4.2 U103.17(PA3/U2_RX/ADC3/TIM2_CH4)
PA9_USART1_TX: U103.42(PA9/U1_TX/TIM1_CH2)
PA10_USART1_RX: U103.43(PA10/U1_RX/TIM1_CH3)
PA11_W5500_/INT: U103.44(PA11/CAN_RX/USBDM/TIM1_CH4)  [project net /INT]
PA12_W5500_/RESET: U103.45(PA12/CAN_TX/USBDP/TIM1_ETR)  [project net /RESET]
PB10_USART3_TX: U103.29(PB10/I2C2_SCL/U3_TX)
PB11_USART3_RX: U103.30(PB11/I2C2_SDA/U3_RX)
PB12_SPI2_NSS: U103.33(PB12/SPI2_NSS/I2C2_SMBAI/TIM1_BKIN)  [project net /SPI_SCS]
PB13_SPI2_SCK: U103.34(PB13/SPI2_SCK/TIM1_CH1N)
PB14_SPI2_MISO: U103.35(PB14/SPI2_MISO/TIM1_CH2N)
PB15_SPI2_MOSI: U103.36(PB15/SPI2_MOSI/TIM1_CH3N)
S1: R33.1 S2.1 S2.4 U103.8(PC0/ADC10)
STM_SWC: SWD1.1 U103.49(PA14/JTCK/SWCLK)
STM_SWD: SWD1.2 U103.46(PA13/JTMS/SWDIO)
NetC4_2: C4.2 R30.2 U103.5(PD0/OSCIN) Y1.2(OSC2)
NetC6_2: C6.2 R30.1 U103.6(PD1/OSCOUT) Y1.1(OSC1)
NetD19_A: D19.A R32.2
NetD20_A: D20.A R34.2
NetD21_A: D21.A R36.1
NetD32_A: D32.A R71.2
NetD33_A: D33.A R70.2
NetR26_2: R26.2 U103.1(VBAT)

Not connected (* = marked no-connect by the designer): U6#1 1(GND) 2(TXD) 3(RXD) 4(V3) 5(D+) 6(D-) 7(XI) 8(XO) 9(CTS#) 10(DSR#) 11(RI#) 12(DCD#) 13(DTR#) 14(RTS) 15(RS232) 16(VCC); U103 2(PC13/ANT1)* 3(PC14/OSC32)* 4(PC15/OSC32)* 9(PC1/ADC11)* 10(PC2/ADC12)* 14(PA0/WKUP/ADC0/TIM2_CH1_ETR)* 15(PA1/ADC1/TIM2_CH2)* 40(PC9)* 62(PB9/TIM4_CH4)*

### Library data of the parts
C4 C6 C18#1 C19#1 = Cap: Capacitor; Published: 8-Jun-2000; LatestRevisionDate: 17-Jul-2002; LatestRevisionNote: Re-released for DXP Platform.; PackageReference: RAD-0.3; Publisher: Altium Limited; Value: 22pF
C5 = CAP: Capacitor; Value: 100nF; Published: 8-Jun-2000; Revision: July-2002: Re-released for DXP Platform.; Publisher: Altium Limited
C7 = Cap: Capacitor; Value: 0.1uF; Published: 8-Jun-2000; LatestRevisionDate: 17-Jul-2002; LatestRevisionNote: Re-released for DXP Platform.; PackageReference: RAD-0.3; Publisher: Altium Limited
C8 C10-C12 C14#1 C14#2 C15 C23#1 = CAP: Capacitor
CON1#2 = 4 HEADER: 4 Pin Header
D7#2 D16#2 = DIODE
D19-D21 D32 D33 = 0603 绿灯: 发光二极管; ComponentLink1Description: 供应商链接; ComponentLink1URL: http://www.szlcsc.com/product/details_73152.html; Package: 0603; Supplier: LC; SuppliersPartNumber: C72043
E6#2 E11 = ELECTRO2: Electrolytic Capacitor
F2#2 = Fuse1: 保险丝
P4 = Header 3: 接插件; LatestRevisionDate: 17-Jul-2002; LatestRevisionNote: Re-released for DXP Platform.; Publisher: Altium Limited
Q7 = S8050
R15#2 R27 R28#1 R29 R70 R71 = Res2: Resistor; Published: 8-Jun-2000; LatestRevisionDate: 17-Jul-2002; LatestRevisionNote: Re-released for DXP Platform.; PackageReference: AXIAL-0.4; Publisher: Altium Limited; Value: 10K
R16#2 R17#2 R18#2 R26 R30 = Res2: Resistor; Value: 10K; Published: 8-Jun-2000; LatestRevisionDate: 17-Jul-2002; LatestRevisionNote: Re-released for DXP Platform.; PackageReference: AXIAL-0.4; Publisher: Altium Limited
R28#2 R31 R35 = RES2
R32-R34 R36 = R: 贴片电阻; Published: 8-Jun-2000; LatestRevisionDate: 17-Jul-2002; LatestRevisionNote: Re-released for DXP Platform.; PackageReference: AXIAL-0.4; Publisher: Altium Limited
  R32 R34 R36: Value: 1K
  R33: Value: 10K
S1 S2 = SW-: 微动开关; Published: 24-Mar-1999; LatestRevisionDate: 17-Jul-2002; LatestRevisionNote: Re-released for DXP Platform.; PackageReference: SPST-2; Publisher: Altium Limited
SWD1 = Header 5: Header, 5-Pin; LatestRevisionDate: 17-Jul-2002; LatestRevisionNote: Re-released for DXP Platform.; Publisher: Altium Limited
U3 = AT2: EEROM存储器
U103 = STM32F103RBT6
USB1 = CON5: Connector
Y1 Y2#1 = XTAL: Crystal Oscillator; Published: 8-Jun-2000; LatestRevisionDate: 17-Jul-2002; LatestRevisionNote: Re-released for DXP Platform.; PackageReference: R38; Publisher: Altium Limited

## Sheet W5500.SchDoc
size A4
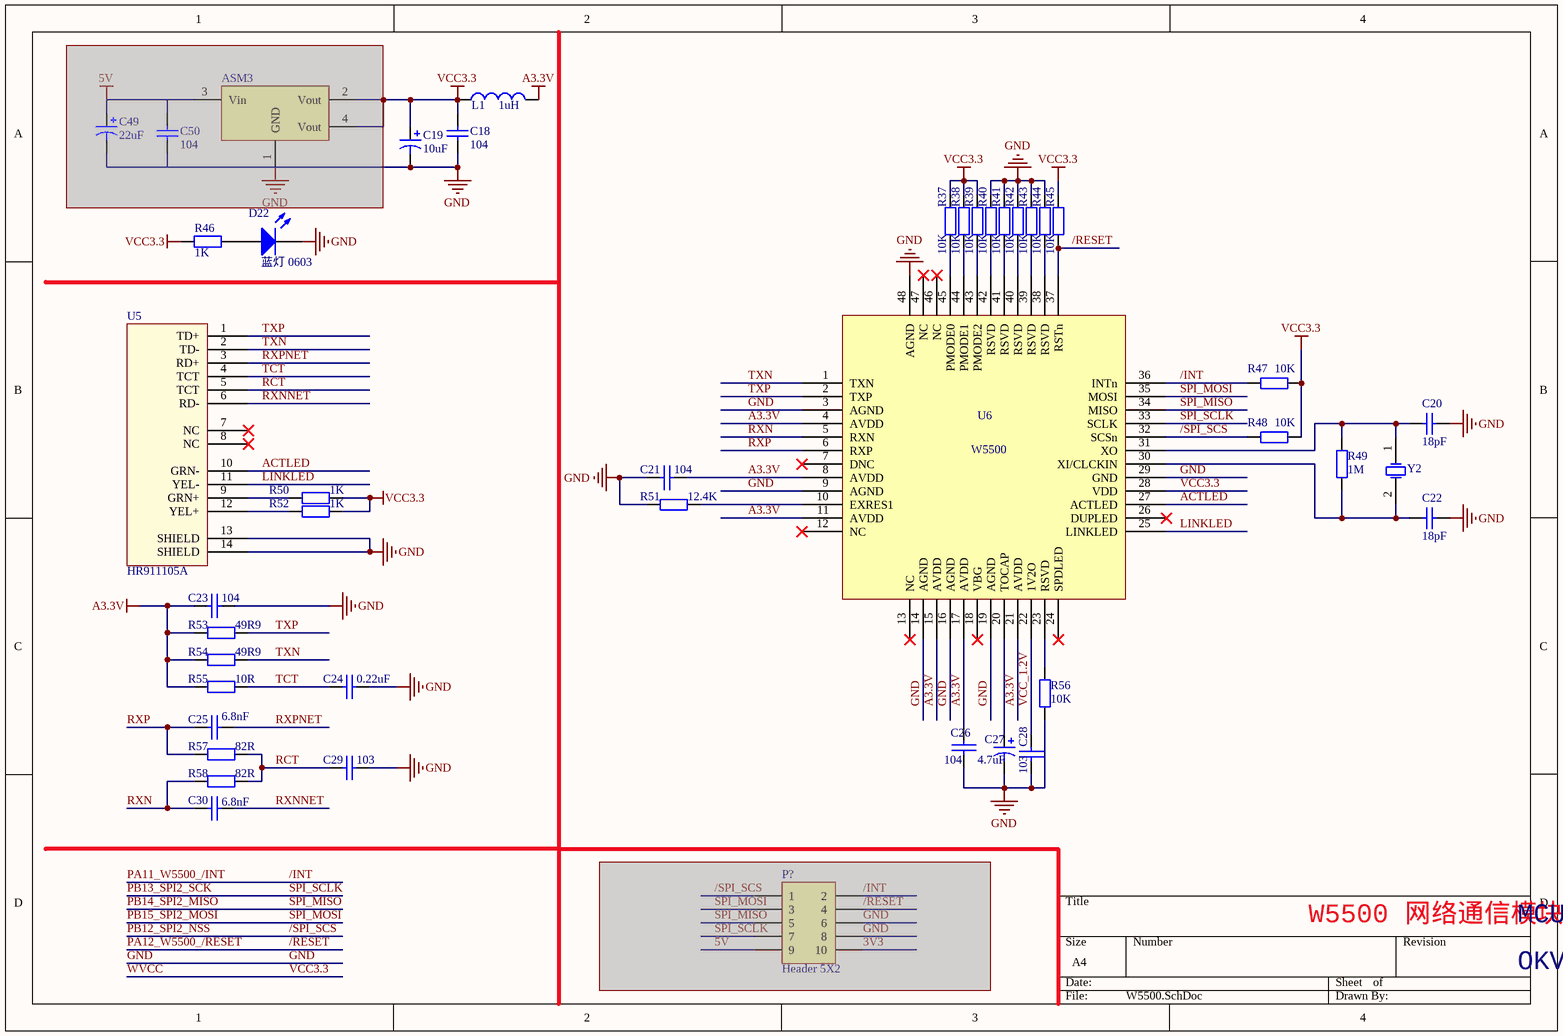
[diagram p6: W5500.SchDoc]

### Parts
(Parts that share a designator on the sheet are numbered #1, #2 ... from top to bottom, then left to right.)
ASM3  ASM1117-3.3  [LC-SOT-89(SOT-89-3)]  (value not drawn)  (masked out: inside a compile mask, not in the netlist)
C18#2  104  [LC-0603_C]
C19#2  10uF  [LC-CASE-A_3216]
C20  18pF  [LC-0603_C]
C21  104  [LC-0603_C]
C22  18pF  [LC-0603_C]
C23#2  104  [LC-0603_C]
C24  0.22uF  [LC-0603_C]
C25  6.8nF  [LC-0603_C]
C26  104  [LC-0603_C]
C27  4.7uF  [LC-CASE-A_3216]
C28  103  [LC-0603_C]
C29  103  [LC-0603_C]
C30  6.8nF  [LC-0603_C]
C49  22uF  [LC-CASE-B_3528]  (masked out: inside a compile mask, not in the netlist)
C50  104  [LC-0603_C]  (masked out: inside a compile mask, not in the netlist)
D22  蓝灯 0603  [LC-0603_LED_S1]
L1  1uH  [LC-0805_L]
P?  Header 5X2  [F2.54-2*5]  (masked out: inside a compile mask, not in the netlist)
R37  10K  [LC-0603_R]
R38  10K  [LC-0603_R]
R39  10K  [LC-0603_R]
R40  10K  [LC-0603_R]
R41  10K  [LC-0603_R]
R42  10K  [LC-0603_R]
R43  10K  [LC-0603_R]
R44  10K  [LC-0603_R]
R45  10K  [LC-0603_R]
R46  1K  [LC-0603_R]
R47  10K  [LC-0603_R]
R48  10K  [LC-0603_R]
R49  1M  [LC-0603_R]
R50  1K  [LC-0603_R]
R51  12.4K  [LC-0603_R]
R52  1K  [LC-0603_R]
R53  49R9  [LC-0603_R]
R54  49R9  [LC-0603_R]
R55  10R  [LC-0603_R]
R56  10K  [LC-0603_R]
R57  82R  [LC-0603_R]
R58  82R  [LC-0603_R]
U5  HR911105A  [HR911105A]
U6#2  W5500  [LQFP48]
Y2#2  25MHz  [LC-HC-49SMD]  (value not drawn)

### Nets
A3.3V: C21.2 C23#2.2 C26.1 L1.2 R53.1 R54.1 R55.1 U6#2.4(AVDD) U6#2.8(AVDD) U6#2.11(AVDD) U6#2.15(AVDD) U6#2.17(AVDD) U6#2.21(AVDD)
GND: C18#2.1 C19#2.2 C20.1 C21.1 C22.1 C23#2.1 C24.2 C26.2 C27.2 C28.2 C29.1 D22.K R40.1 R41.1 R42.1 R43.1 R44.1 R51.2 R56.2 U5.13(SHIELD) U5.14(SHIELD) U6#2.3(AGND) U6#2.9(AGND) U6#2.14(AGND) U6#2.16(AGND) U6#2.19(AGND) U6#2.29(GND) U6#2.48(AGND)
VCC3.3: C18#2.2 C19#2.1 L1.1 R37.1 R38.1 R39.1 R45.1 R46.2 R47.1 R48.1 R50.2 R52.2 U6#2.28(VDD)  [also labelled WVCC]
/INT: R47.2 U6#2.36(INTn)  [also labelled PA11_W5500_/INT]
/RESET: R45.2 U6#2.37(RSTn)  [also labelled PA12_W5500_/RESET]
/SPI_SCS: R48.2 U6#2.32(SCSn)  [also labelled PB12_SPI2_NSS]
ACTLED: U5.10(GRN-) U6#2.27(ACTLED)
LINKLED: U5.11(YEL-) U6#2.25(LINKLED)
PB13_SPI2_SCK: U6#2.33(SCLK)  [also labelled SPI_SCLK]
PB14_SPI2_MISO: U6#2.34(MISO)  [also labelled SPI_MISO]
PB15_SPI2_MOSI: U6#2.35(MOSI)  [also labelled SPI_MOSI]
RCT: C29.2 R57.2 R58.2 U5.5(TCT)
RXN: C30.1 R58.1 U6#2.5(RXN)
RXNNET: C30.2 U5.6(RD-)
RXP: C25.1 R57.1 U6#2.6(RXP)
RXPNET: C25.2 U5.3(RD+)
TCT: C24.1 R55.2 U5.4(TCT)
TXN: R54.2 U5.2(TD-) U6#2.1(TXN)
TXP: R53.2 U5.1(TD+) U6#2.2(TXP)
VCC_1.2V: C28.1 U6#2.22(1V2O)
NetC20_2: C20.2 R49.2 U6#2.31(XO) Y2#2.1(OSC1)
NetC22_2: C22.2 R49.1 U6#2.30(XI/CLCKIN) Y2#2.2(OSC2)
NetC27_1: C27.1 U6#2.20(TOCAP)
NetD22_A: D22.A R46.1
NetR37_2: R37.2 U6#2.45(PMODE0)
NetR38_2: R38.2 U6#2.44(PMODE1)
NetR39_2: R39.2 U6#2.43(PMODE2)
NetR40_2: R40.2 U6#2.42(RSVD)
NetR41_2: R41.2 U6#2.41(RSVD)
NetR42_2: R42.2 U6#2.40(RSVD)
NetR43_2: R43.2 U6#2.39(RSVD)
NetR44_2: R44.2 U6#2.38(RSVD)
NetR50_1: R50.1 U5.9(GRN+)
NetR51_1: R51.1 U6#2.10(EXRES1)
NetR52_1: R52.1 U5.12(YEL+)
NetR56_1: R56.1 U6#2.23(RSVD)

Not connected (* = marked no-connect by the designer): U5 7(NC)* 8(NC)*; U6#2 7(DNC)* 12(NC)* 13(NC)* 18(VBG)* 24(SPDLED)* 26(DUPLED)* 46(NC)* 47(NC)*

### Notes on the sheet
- W5500 网络通信模块
- MCU板
- OKV0.0.0

### Library data of the parts
ASM3 = VOLTREG1
C18#2 C20 C22 C50 = Cap: Capacitor; Published: 8-Jun-2000; LatestRevisionDate: 17-Jul-2002; LatestRevisionNote: Re-released for DXP Platform.; PackageReference: RAD-0.3; Publisher: Altium Limited
  C18#2 C50: Value: 104
  C20 C22: Value: 18pF
C19#2 C27 C49 = Cap Pol3: Polarized Capacitor (Surface Mount); Published: 8-Jun-2000; LatestRevisionDate: 17-Jul-2002; LatestRevisionNote: Re-released for DXP Platform.; PackageReference: C0805; Publisher: Altium Limited
  C19#2: Value: 10uF
  C27: Value: 4.7uF
  C49: Value: 22uF
C21 C23#2 C24-C26 C28-C30 = CAP: Capacitor
D22 = 0603 蓝灯: 发光二极管; ComponentLink1Description: 供应商链接; ComponentLink1URL: http://www.szlcsc.com/product/details_73150.html; Package: 0603; Supplier: LC; SuppliersPartNumber: C72041
L1 = Inductor: Code_IEC: 1005; Published: 8-Jun-2000; LatestRevisionDate: 17-Jul-2002; LatestRevisionNote: Re-released for DXP Platform.; PackageReference: 0402-A; Publisher: Altium Limited; Code_JEITA: 0402; Value: 1uH
P? = Header 5X2: Header, 5-Pin, Dual row; LatestRevisionDate: 17-Jul-2002; LatestRevisionNote: Re-released for DXP Platform.; Publisher: Altium Limited
R37-R50 R52 R55-R58 = Res2: Resistor; Published: 8-Jun-2000; LatestRevisionDate: 17-Jul-2002; LatestRevisionNote: Re-released for DXP Platform.; PackageReference: AXIAL-0.4; Publisher: Altium Limited
  R37-R45 R47 R48 R56: Value: 10K
  R46 R50 R52: Value: 1K
  R49: Value: 1M
  R55: Value: 10R
  R57 R58: Value: 82R
R51 = Res2: Resistor; Value: 12.4K 1%; Published: 8-Jun-2000; LatestRevisionDate: 17-Jul-2002; LatestRevisionNote: Re-released for DXP Platform.; PackageReference: AXIAL-0.4; Publisher: Altium Limited
R53 R54 = Res2: Resistor; Value: 49.9R; Published: 8-Jun-2000; LatestRevisionDate: 17-Jul-2002; LatestRevisionNote: Re-released for DXP Platform.; PackageReference: AXIAL-0.4; Publisher: Altium Limited
U6#2 = W5500: W5500以太网芯片
Y2#2 = XTAL: Crystal Oscillator; Published: 8-Jun-2000; LatestRevisionDate: 17-Jul-2002; LatestRevisionNote: Re-released for DXP Platform.; PackageReference: R38; Publisher: Altium Limited

## Nets that join several sheets
3V3: 74HC245 (18 pins), 232串口 (C31.2 R59.2 R60.1 U7.16), POWER (6 pins), RS485 (ADuM1.1 N1.1), STM32F103最小系统板 (23 pins)
GND: 74HC245 (10 pins), POWER (12 pins), RS485 (ADuM1.4), STM32F103最小系统板 (6 pins), W5500 (28 pins)
GNDIN: POWER (14 pins), RS485 (7 pins)
VCC3.3: 74HC245 (P1.12 P2.12), POWER (Pmos1#2.3 WVCC.1), W5500 (13 pins)
VCC5V: 74HC245 (8 pins), POWER (6 pins)
VCCIN5V: 74HC245 (P1.6 P2.6), POWER (7 pins), RS485 (7 pins)
VSS: 74HC245 (P1.16 P2.16), 232串口 (5 pins), POWER (7 pins), STM32F103最小系统板 (22 pins)
245DIRC1: 74HC245 (Q1#1.1), STM32F103最小系统板 (U103.11)
245DIRC2: 74HC245 (Q2.1), STM32F103最小系统板 (U103.61)
/INT: STM32F103最小系统板 (U103.44), W5500 (R47.2 U6#2.36)
/RESET: STM32F103最小系统板 (U103.45), W5500 (R45.2 U6#2.37)
/SPI_SCS: STM32F103最小系统板 (U103.33), W5500 (R48.2 U6#2.32)
IN_OUT1: 74HC245 (D1#1.K U1.2), STM32F103最小系统板 (U103.27)
IN_OUT2: 74HC245 (D3.K U1.3), STM32F103最小系统板 (U103.26)
IN_OUT3: 74HC245 (D5.K U1.4), STM32F103最小系统板 (U103.25)
IN_OUT4: 74HC245 (D7#1.K U1.5), STM32F103最小系统板 (U103.24)
IN_OUT5: 74HC245 (D10.K U1.6), STM32F103最小系统板 (U103.23)
IN_OUT6: 74HC245 (D9.K U1.7), STM32F103最小系统板 (U103.22)
IN_OUT7: 74HC245 (D13.K U1.8), STM32F103最小系统板 (U103.21)
IN_OUT8: 74HC245 (D15.K U1.9), STM32F103最小系统板 (U103.20)
IN_OUT9: 74HC245 (D2.K U2.2), STM32F103最小系统板 (U103.57)
IN_OUT10: 74HC245 (D4.K U2.3), STM32F103最小系统板 (U103.56)
IN_OUT11: 74HC245 (D6.K U2.4), STM32F103最小系统板 (U103.55)
IN_OUT12: 74HC245 (D8.K U2.5), STM32F103最小系统板 (U103.54)
IN_OUT13: 74HC245 (D12.K U2.6), STM32F103最小系统板 (U103.53)
IN_OUT14: 74HC245 (D11.K U2.7), STM32F103最小系统板 (U103.52)
IN_OUT15: 74HC245 (D14.K U2.8), STM32F103最小系统板 (U103.51)
IN_OUT16: 74HC245 (D16#1.K U2.9), STM32F103最小系统板 (U103.50)
InternetRST: POWER (R68.2), STM32F103最小系统板 (U103.39)
PA1_RS485_RD: RS485 (R22.1), STM32F103最小系统板 (U103.41)
PA9_USART1_TX: RS485 (ADuM1.3), STM32F103最小系统板 (U103.42)
PA10_USART1_RX: RS485 (ADuM1.2), STM32F103最小系统板 (U103.43)
PB10_USART3_TX: 232串口 (D24.K U7.10), STM32F103最小系统板 (U103.29)
PB11_USART3_RX: 232串口 (D23.K U7.9), STM32F103最小系统板 (U103.30)
PB13_SPI2_SCK: STM32F103最小系统板 (U103.34), W5500 (U6#2.33)
PB14_SPI2_MISO: STM32F103最小系统板 (U103.35), W5500 (U6#2.34)
PB15_SPI2_MOSI: STM32F103最小系统板 (U103.36), W5500 (U6#2.35)